# EAGLE design soar (EAGLE 8.3.1)
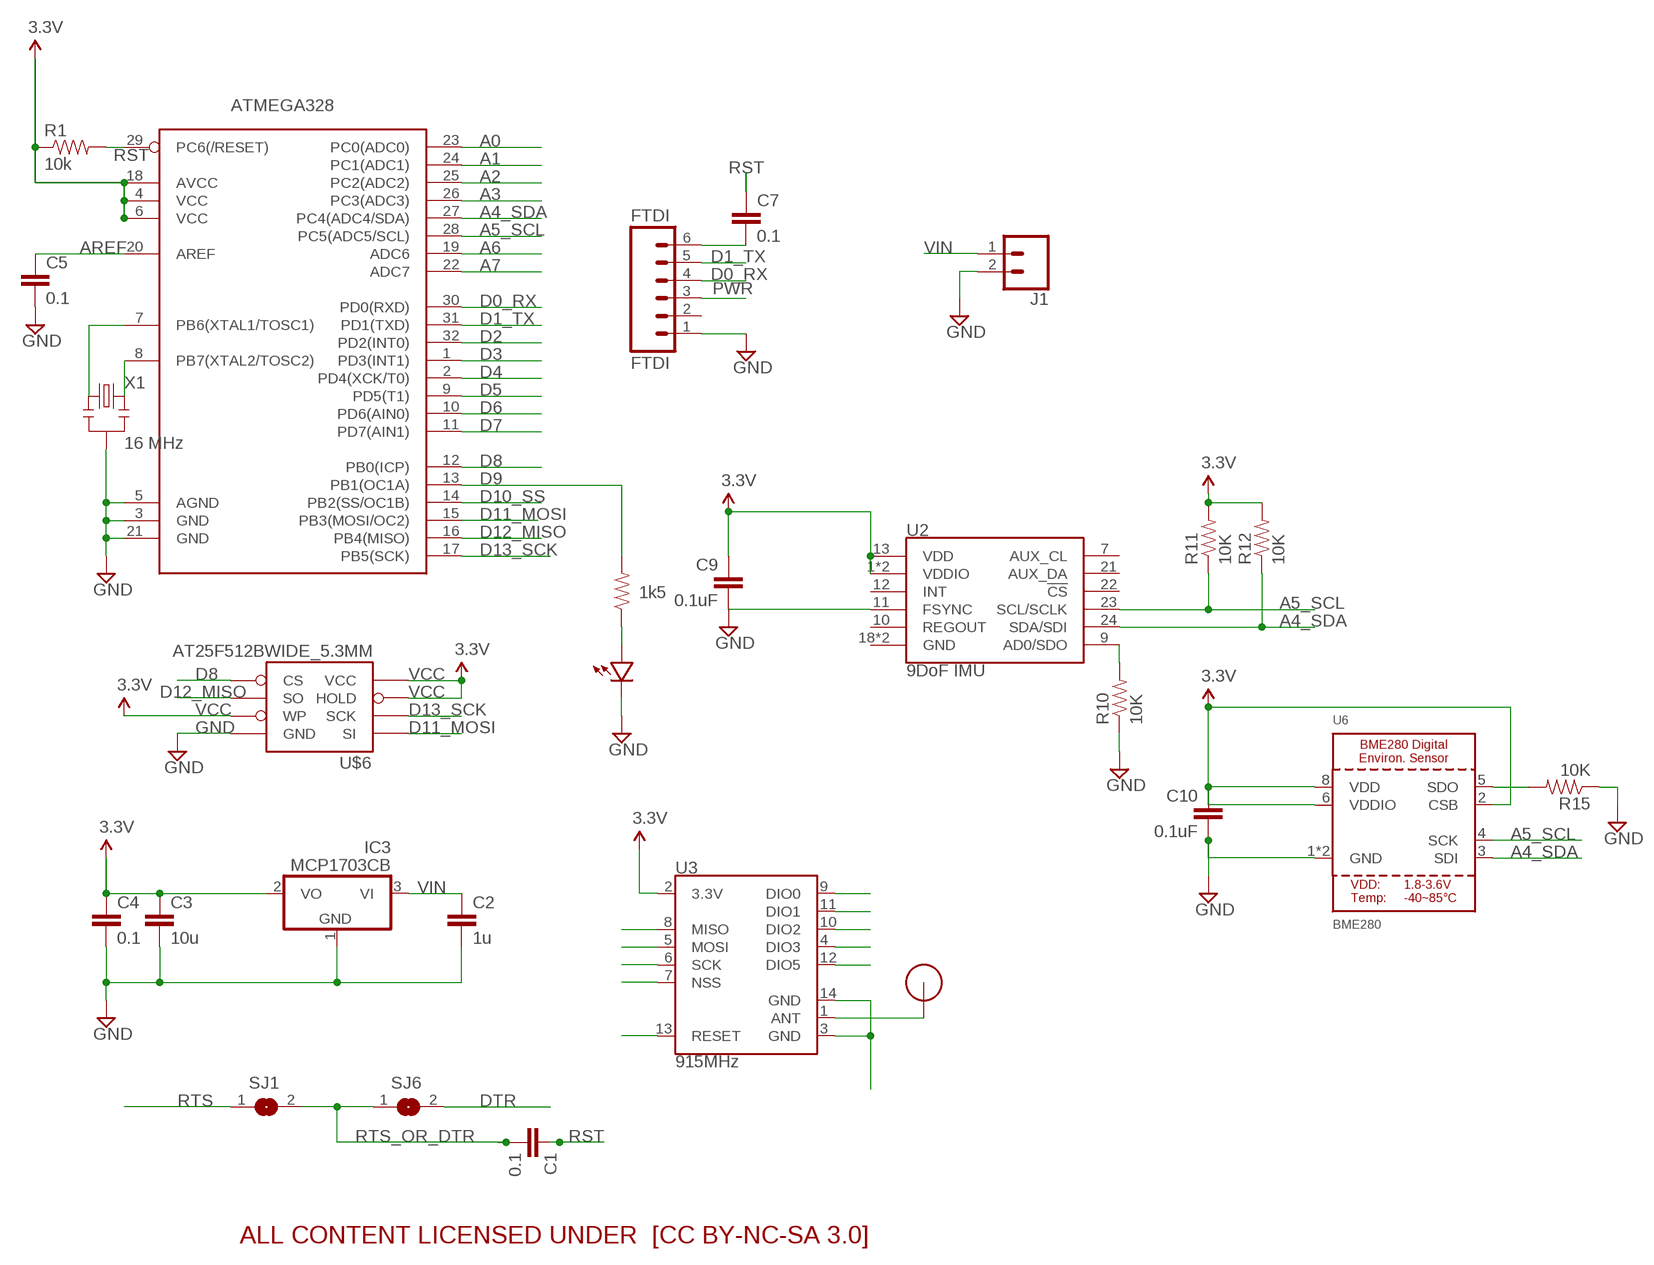
[diagram p0: schematic, sheet 1]

## Parts
ATMEGA328  ATMega-328  ATMEGA168/328TQFP32  [TQFP32-08]
C1  0.1  CAP0603-CAP  [0603-CAP]
C2  1u  CAP0603-CAP  [0603-CAP]
C3  10u  CAP0805-CAP  [0805-CAP]
C4  0.1  CAP0603-CAP  [0603-CAP]
C5  0.1  CAP0603-CAP  [0603-CAP]
C7  0.1  CAP0603-CAP  [0603-CAP]
C9  0.1uF  0.1UF-25V(+80/-20%)(0603)  [0603-CAP]
C10  0.1uF  0.1UF-25V(+80/-20%)(0603)  [0603-CAP]
FTDI  FTDI  M06SIP  [1X06]
IC3  MCP1703CB  [SOT23]
J1  CONN_02-JST-2-PTH-NO_SILK  [JST-2-PTH-NS]
R1  10k  RESISTOR0603-RES  [0603-RES]
R2  1k5  RESISTOR0603-RES  [0603-RES]
R10  10K  10KOHM-1/10W-1%(0603)0603  [0603-RES]
R11  10K  10KOHM-1/10W-1%(0603)0603  [0603-RES]
R12  10K  10KOHM-1/10W-1%(0603)0603  [0603-RES]
R15  10K  10KOHM-1/10W-1%(0603)0603  [0603-RES]
SJ1  JUMPER  [SJW]
SJ6  JUMPER  [SJW]
U2  9DoF IMU  MPU-9250  [QFN24-3X3]
U3  915MHz  RFM69CW-915MHZ  [RFM69CW-XXXS2]
U6  BME280  [BME280]
U$2  LED0603  [0603-LED]
U$3  RFM12B_ANTENNA  [RFM12B-ANTENNA]
U$6  AT25F512BWIDE_5.3MM  [SO08WIDE]
X1  16 MHz  RESONATORSMD  [RESONATOR-SMD]

## Nets
A0: ATMEGA328.23(PC0(ADC0))
A1: ATMEGA328.24(PC1(ADC1))
A2: ATMEGA328.25(PC2(ADC2))
A3: ATMEGA328.26(PC3(ADC3))
A4_SDA: ATMEGA328.27(PC4(ADC4/SDA)) R12.1 U2.24(SDA/SDI) U6.3(SDI)
A5_SCL: ATMEGA328.28(PC5(ADC5/SCL)) R11.1 U2.23(SCL/SCLK) U6.4(SCK)
A6: ATMEGA328.19(ADC6)
A7: ATMEGA328.22(ADC7)
AREF: ATMEGA328.20(AREF) C5.1
D0_RX: ATMEGA328.30(PD0(RXD)) FTDI.4
D1_TX: ATMEGA328.31(PD1(TXD)) FTDI.5
D2: ATMEGA328.32(PD2(INT0)) U3.9(DIO0)
D3: ATMEGA328.1(PD3(INT1))
D4: ATMEGA328.2(PD4(XCK/T0))
D5: ATMEGA328.9(PD5(T1))
D6: ATMEGA328.10(PD6(AIN0))
D7: ATMEGA328.11(PD7(AIN1))
D8: ATMEGA328.12(PB0(ICP)) U$6.1(CS)
D9: ATMEGA328.13(PB1(OC1A)) R2.2
D10_SS: ATMEGA328.14(PB2(SS/OC1B)) U3.7(NSS)
D11_MOSI: ATMEGA328.15(PB3(MOSI/OC2)) U3.5(MOSI) U$6.5(SI)
D12_MISO: ATMEGA328.16(PB4(MISO)) U3.8(MISO) U$6.2(SO)
D13_SCK: ATMEGA328.17(PB5(SCK)) U3.6(SCK) U$6.6(SCK)
DTR: SJ6.2
GND [power]: ATMEGA328.3(GND) ATMEGA328.5(AGND) ATMEGA328.21(GND) C2.2 C3.2 C4.2 C5.2 C10.2 FTDI.1 IC3.1(GND) J1.2 R10.1 R15.1 U6.1(GND) U6.7(GND) U$2.MINUS U$6.4(GND) X1.2
N$1: ATMEGA328.7(PB6(XTAL1/TOSC1)) X1.1
N$2: R2.1 U$2.PLUS
N$3: C9.2 U2.11(FSYNC)
N$10: R15.2 U6.5(SDO)
N$11: R10.2 U2.9(AD0/SDO)
N$12: C7.2 FTDI.6
N$14: U3.13(RESET)
N$16: U3.11(DIO1)
N$17: U3.10(DIO2)
N$18: U3.4(DIO3)
N$19: U3.12(DIO5)
N$20: U3.3(GND) U3.14(GND)
N$21: ATMEGA328.8(PB7(XTAL2/TOSC2)) X1.3
N$22: U3.1(ANT) U$3.P$1
PWR [power]: FTDI.3
RST: ATMEGA328.29(PC6(/RESET)) C1.1 C7.1 R1.2
RTS: SJ1.1
RTS_OR_DTR: C1.2 SJ1.2 SJ6.1
VCC: ATMEGA328.4(VCC) ATMEGA328.6(VCC) ATMEGA328.18(AVCC) C3.1 C4.1 C9.1 C10.1 IC3.2(VO) R1.1 R11.2 R12.2 U2.1(VDDIO) U2.8(VDDIO) U2.13(VDD) U3.2(3.3V) U6.2(CSB) U6.6(VDDIO) U6.8(VDD) U$6.3(WP) U$6.7(HOLD) U$6.8(VCC) ; supply symbol labelled 3.3V
VIN: C2.1 IC3.3(VI) J1.1
Unconnected: FTDI.2 U2.7(AUX_CL) U2.10(REGOUT) U2.12(INT) U2.18(GND) U2.20(GND) U2.21(AUX_DA) U2.22(!CS)

## Notes on the sheet
- ALL CONTENT LICENSED UNDER  [CC BY-NC-SA 3.0]

## Library data of the parts
ATMEGA328 = LowPowerLab:ATMEGA168/328: Atmel 32-pin 8-bit micro, 16k flash.
C1-C5 C7 = LowPowerLab:CAP: Capacitor Standard 0603 ceramic capacitor, and 0.1" leaded capacitor.
C9 C10 = SparkFun-Capacitors:0.1UF-25V(+80/-20%)(0603): CAP-00810 Ceramic Standard decoupling cap; PROD_ID: CAP-00810
FTDI = SparkFun-Connectors:M06: Header 6 Standard 6-pin 0.1" header. Use with straight break away headers (SKU : PRT-00116), right angle break away headers (PRT-00553), swiss pins (PRT-00743), machine pins (PRT-00117), and female headers (PRT-00115). Molex polarized connector foot print use with SKU : PRT-08094 with associated crimp pins and housings. NOTES ON THE VARIANTS LOCK and LOCK_LONGPADS... This footprint was designed to help hold the alignment of a through-hole component (i.e. 6-pin header) while soldering it into place. You may notice that each hole has been shifted either up or down by 0.005 of an inch from it's more standard position (which is a perfectly straight line). This slight alteration caused the pins (the squares in the middle) to touch the edges of the holes. Because they are alternating, it causes a "brace" to hold the component in place. 0.005 has proven to be the perfect amount of "off-center" position when using our standard breakaway headers. Although looks a little odd when you look at the bare footprint, once you have a header in there, the alteration is very hard to notice. Also, if you push a header all the way into place, it is covered up entirely on the bottom side. This idea of altering the position of holes to aid alignment will be further integrated into the Sparkfun Library for other footprints. It can help hold any component with 3 or more connection pins.
IC3 = linear:MCP1703: 250 mA, 16V, Low Quiescent Current LDO Regulator Source: http://ww1.microchip.com/downloads/en/DeviceDoc/22049b.pdf
J1 = SparkFun-Connectors:CONN_02: Multi connection point. Often used as Generic Header-pin footprint for 0.1 inch spaced/style header connections On any of the 0.1 inch spaced packages, you can populate with these: Break Away Headers - Straight <https://www.sparkfun.com/products/116> (PRT-00116) Break Away Male Headers - Right Angle <https://www.sparkfun.com/products/553> (PRT-00553) Female Headers <https://www.sparkfun.com/products/115> (PRT-00115) Break Away Headers - Machine Pin <https://www.sparkfun.com/products/117> (PRT-00117) Break Away Female Headers - Swiss Machine Pin <https://www.sparkfun.com/products/743> (PRT-00743) For SCREWTERMINALS and SPRING TERMINALS visit here: Screw Terimnals on SparkFun.com <https://www.sparkfun.com/search/results?term=Screw+Terminals> (5mm/3.5mm/2.54mm spacing) This device is also useful as a general connection point to wire up your design to another part of your project. Our various solder wires solder well into these plated through hole pads. Hook-Up Wire - Assortment (Stranded, 22 AWG) <https://www.sparkfun.com/products/11375> (PRT-11375) Hook-Up Wire - Assortment (Solid Core, 22 AWG) <https://www.sparkfun.com/products/11367> (PRT-11367) View the entire wire category on our website here <https://www.sparkfun.com/categories/141> Special notes: Molex polarized connector foot print use with: PRT-08233 with associated crimp pins and housings. 2.54_SCREWTERM for use with PRT-10571. 3.5mm Screw Terminal footprints for PRT-08084 5mm Screw Terminal footprints for use with PRT-08432
R1 R2 = LowPowerLab:RESISTOR: Resistor Basic schematic elements and footprints for 0603, 1206, and PTH resistors.
R10-R12 R15 = SparkFun-Resistors:10KOHM-1/10W-1%(0603): RES-00824; PROD_ID: RES-00824
SJ1 SJ6 = LowPowerLab:JUMPER
U2 = SparkFun-Sensors:MPU-9250: MPU-9250 9 Degree of Freedom IMU System in Package that contains MPU-6500 & AK8963 NC pin 19. 2-6 & 14-17 not internally connected. May be used for PCB trace routing. Datasheet <https://cdn.sparkfun.com/assets/learn_tutorials/5/5/0/MPU9250REV1.0.pdf> SparkFun Products: SparkFun 9DoF Razor IMU M0 <https://www.sparkfun.com/products/14001> SparkFun IMU Breakout - MPU-9250 <https://www.sparkfun.com/products/13762>; PROD_ID: IC-13192
U3 = SparkFun-RF:RFM69: Hope RF RFM69CW ISM Transceiver Module The RFM69CW radio module by HopeRF is a compact, powerful radio transceiver module for swapping data packets in the 868 MHz ISM band, using standard and enhanced FSK modulation. The radio is great for sub-compact designs; just 4mm of mounted height from using an SMD precision crystal. Datasheet <http://www.hoperf.com/upload/rf/RFM69CW-V1.1.pdf>; PROD_ID: IC-11996
U6 = microbuilder:BME280: BME280 - Environmental Sensor (I2C + SPI)
U$2 = LowPowerLab:LED
U$3 = LowPowerLab:RFM12B_ANTENNA
U$6 = LowPowerLab:AT25F512B: 4-Mbit SPI flash memory
X1 = SparkFun:RESONATOR: Resonator Small SMD resonator. This is the itty bitty 10/20MHz resonators with built in caps. CSTCE10M0G55 and CSTCE20M0V53. Footprint has been reviewed closely but hasn't been tested yet.

## Net classes
1 power: width 0.381 mm, clearance 0.254 mm

## Board
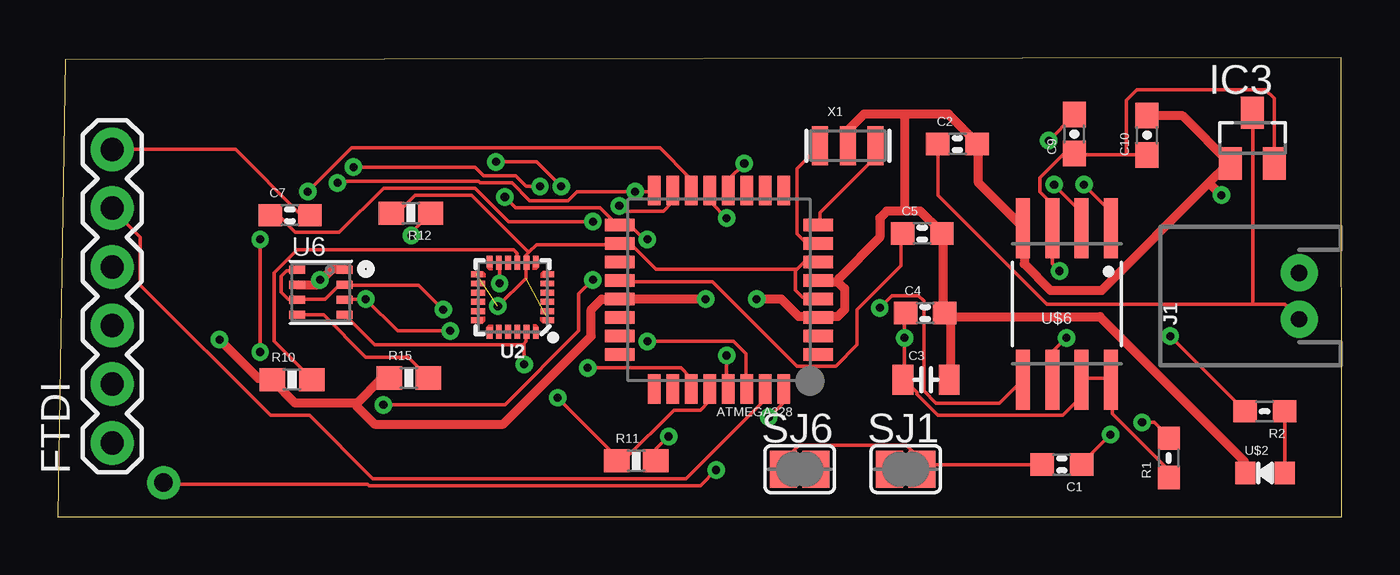
[diagram p1: board, top side]
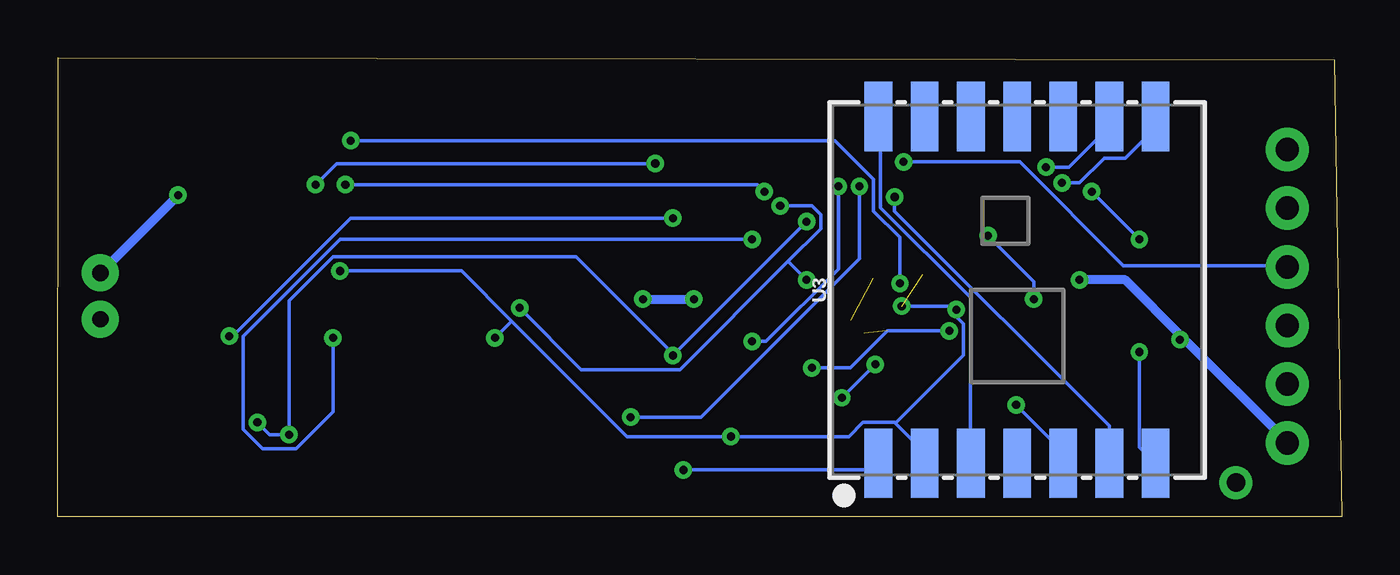
[diagram p2: board, bottom side, seen from below]

Size 55.58 x 19.86 mm. Coordinates in mm from the lower left corner, seen from the top.
Outline: 0,0 55.58,0 55.56,19.86 0.32,19.77 0,0
Copper layers (1*16): Top 0.035mm / dielectric 1.5mm / Bottom 0.035mm
Design rules "default": minimum track width 6mil, minimum drill 0.35mm, track to track 6mil, track to pad 6mil, pad to pad 6mil, via to via 6mil, smd to smd 6mil, copper to edge 40mil, drill to drill 6mil, minimum pad ring 10mil, minimum via ring 8mil, stop-mask expansion 4mil, vias tented up to drill 0mil, thermal gap 10mil

### Footprints (pad centres in the part's own frame; a part is rotated, then mirrored left to right if it is on the bottom)
TQFP32-08 = smd 1.27 x 0.533: 1 -4.293,2.8; 2 -4.293,2; 3 -4.293,1.2; 4 -4.293,0.4; 5 -4.293,-0.4; 6 -4.293,-1.2; 7 -4.293,-2; 8 -4.293,-2.8; 17 4.293,-2.8; 18 4.293,-2; 19 4.293,-1.2; 20 4.293,-0.4; 21 4.293,0.4; 22 4.293,1.2; 23 4.293,2; 24 4.293,2.8 | smd 0.533 x 1.27: 9 -2.8,-4.293; 10 -2,-4.293; 11 -1.2,-4.293; 12 -0.4,-4.293; 13 0.4,-4.293; 14 1.2,-4.293; 15 2,-4.293; 16 2.8,-4.293; 25 2.8,4.293; 26 2,4.293; 27 1.2,4.293; 28 0.4,4.293; 29 -0.4,4.293; 30 -1.2,4.293; 31 -2,4.293; 32 -2.8,4.293
0603-CAP = smd 1.016 x 0.965: 1 -0.85,0; 2 0.85,0
0805-CAP = smd 0.902 x 1.3: 1 -1,0; 2 1,0
0603-CAP' = smd 1.1 x 1: 1 -0.85,0; 2 0.85,0
1X06 = drill 1.016 pad 1.88: 1 0,0; 2 2.54,0; 3 5.08,0; 4 7.62,0; 5 10.16,0; 6 12.7,0
SOT23 = smd 1 x 1.4: 1 -0.95,-1.1; 2 0.95,-1.1; 3 0,1.1
JST-2-PTH-NS = drill 0.7 pad 1.6: 1 -1,0; 2 1,0
0603-RES = smd 1.016 x 0.965: 1 -0.85,0; 2 0.85,0
0603-RES' = smd 1.1 x 1: 1 -0.85,0; 2 0.85,0
SJW = smd 1.168 x 1.6: 1 -0.711,0; 2 0.711,0
QFN24-3X3 = smd 0.495 x 0.25: 1 -1.552,1; 6 -1.552,-1; 13 1.552,-1; 18 1.552,1 | smd 0.6 x 0.25: 2 -1.5,0.6; 3 -1.5,0.2; 4 -1.5,-0.2; 5 -1.5,-0.6; 14 1.5,-0.6; 15 1.5,-0.2; 16 1.5,0.2; 17 1.5,0.6 | smd 0.25 x 0.495: 7 -1,-1.552; 12 1,-1.552; 19 1,1.552; 24 -1,1.552 | smd 0.25 x 0.6: 8 -0.6,-1.5; 9 -0.2,-1.5; 10 0.2,-1.5; 11 0.6,-1.5; 20 0.6,1.5; 21 0.2,1.5; 22 -0.2,1.5; 23 -0.6,1.5
RFM69CW-XXXS2 = smd 3 x 1.2: 1 -7.5,6; 2 -7.5,4; 3 -7.5,2; 4 -7.5,0; 5 -7.5,-2; 6 -7.5,-4; 7 -7.5,-6; 8 7.5,-6; 9 7.5,-4; 10 7.5,-2; 11 7.5,0; 12 7.5,2; 13 7.5,4; 14 7.5,6
BME280 = smd 0.7 x 0.35: 1 1.025,0.975; 2 1.025,0.325; 3 1.025,-0.325; 4 1.025,-0.975; 5 -1.025,-0.975; 6 -1.025,-0.325; 7 -1.025,0.325; 8 -1.025,0.975
0603-LED = smd 0.864 x 0.965: MINUS -0.85,0; PLUS 0.85,0
RFM12B-ANTENNA = drill 0.8 pad 1.422: P$1 0,0
SO08WIDE = smd 0.61 x 2.6: 1 -1.905,-3.269; 2 -0.635,-3.269; 3 0.635,-3.269; 4 1.905,-3.269; 5 1.905,3.286; 6 0.635,3.286; 7 -0.635,3.286; 8 -1.905,3.286
RESONATOR-SMD = smd 0.7 x 1.7: 1 -1.2,0; 2 0,0; 3 1.2,0

### Placement (x,y rotation side)
ATMEGA328  28.62,9.82 180 top
C1  43.46,2.26 180 top
C2  38.94,16.13 0 top
C3  37.59,5.94 0 top
C4  37.55,8.81 0 top
C5  37.42,12.26 0 top
C7  10.06,13.05 0 top
C9  0.1uF  [0603-CAP']  44,16.56 90 top
C10  0.1uF  [0603-CAP']  47.15,16.51 90 top
FTDI  2.36,3.2 90 top
IC3  51.71,16.38 0 top
J1  53.73,9.55 90 top
R1  48.09,2.55 90 top
R2  52.24,4.57 180 top
R10  10K  [0603-RES']  10.14,5.93 0 top
R11  10K  [0603-RES']  25.04,2.42 0 top
R12  10K  [0603-RES']  15.29,13.14 180 top
R15  10K  [0603-RES']  15.2,6 0 top
SJ1  36.7,2.06 0 top
SJ6  32.12,2.06 0 top
U2  19.69,9.5 180 top
U3  14.06,9.82 90 bottom
U6  11.39,9.72 0 top
U$2  52.26,1.9 0 top
U$3  4.58,1.48 0 top
U$6  43.68,9.22 180 top
X1  34.2,16.06 0 top

### Tracks (layer width: path | path; a pad name or v marks a point on that pad's centre or on a via)
A4_SDA  (via drill 0.35)  (1 unrouted)
  Top 0.152: v15.31,12.16 15.31,12.31 16.08,13.08 R12.1 | U6.3 12.42,9.42 v13.33,9.42 14.7,8.05 v16.99,8.05 | v22.93,6.45 26.97,6.45 27.35,6.07 27.35,5.53 ATMEGA328.27
  Bottom 0.152: v13.33,9.42 13.33,10.18 v15.31,12.16 | v22.93,6.45 21.26,6.45 19.66,8.05 v16.99,8.05
A5_SCL  (via drill 0.35)
  Top 0.152: ATMEGA328.28 28.19,5.46 28.19,5 27.81,4.62 26.67,4.62 24.53,2.48 24.23,2.48 R11.1 24.23,2.56 v21.64,5.15 | 20.15,7.47 20.11,7.44 13.71,7.44 U6.4 | 20.15,7.47 20.27,7.59 20.27,7.97 U2.23 | v20.19,6.6 20.19,7.44 20.15,7.47
  Bottom 0.152: v20.19,6.6 v21.64,5.15
AREF
  Top 0.152: C5.1 36.5,12.24 36.5,10.87 34.59,8.96 34.59,7.44 33.68,6.52 32,6.52 28.34,10.18 24.38,10.18 ATMEGA328.20
D0_RX  (via drill 0.35)
  Top 0.152: v25.52,7.59 29.26,7.59 29.79,7.06 29.79,5.53 ATMEGA328.30 | v21.79,14.29 20.72,15.36 v18.97,15.36
  Bottom 0.152: v25.52,7.59 24.92,7.59 21.79,10.71 v21.79,14.29 | v18.97,15.36 13.94,15.36 9.45,10.87 2.36,10.87 FTDI.4
D1_TX
  Top 0.152: ATMEGA328.31 30.55,5.46 30.55,5 27.2,1.65 13.64,1.65 10.89,4.39 9.22,4.39 3.58,10.03 3.58,12.08 2.36,13.3 FTDI.5
D2  (via drill 0.35)
  Top 0.152: v30.78,4.31 31.39,4.92 31.39,5.46 ATMEGA328.32 | v20.88,14.29 20.27,14.29 19.81,14.75 18.44,14.75 18.06,15.13 v12.8,15.13
  Bottom 0.152: v30.78,4.31 27.73,4.31 20.88,11.17 v20.88,14.29 | v12.8,15.13 11.81,15.13 10.06,16.89 10.06,17.27 U3.9
D8  (via drill 0.35)
  Top 0.152: v29.72,15.29 29.03,14.6 29.03,14.14 ATMEGA328.12 | v44.42,14.37 45.57,13.23 45.57,12.54 U$6.1
  Bottom 0.152: v29.72,15.29 43.51,15.29 v44.42,14.37
D9  (via drill 0.35)
  Top 0.152: v48.16,7.82 51.36,4.62 R2.2 | v28.95,12.92 28.27,13.61 28.27,14.07 ATMEGA328.13
  Bottom 0.152: v48.16,7.82 48,7.82 42.9,12.92 v28.95,12.92
D10_SS  (via drill 0.35)
  Top 0.152: v10.82,14.07 12.72,15.97 26.06,15.97 27.35,14.68 27.35,14.14 ATMEGA328.14 | v8.76,7.13 v8.76,12.01
  Bottom 0.152: v8.76,12.01 v10.82,14.07 | v8.76,7.13 8.76,3.02 8.07,2.33 U3.7
D11_MOSI  (via drill 0.35)
  Top 0.152: v24.31,13.46 24.53,13.23 26.21,13.23 26.59,13.61 26.59,14.07 ATMEGA328.15 | v35.58,9.04 36.12,9.57 37.26,9.57 37.49,9.34 37.49,5.46 38.02,4.92 40.76,4.92 41.76,5.91 U$6.5 | v14.09,4.85 19.35,4.85 22.55,8.05 22.55,9.65 v23.16,10.26
  Bottom 0.152: v24.31,13.46 22.93,13.46 22.55,13.08 22.55,12.47 23.96,11.06 | 23.96,11.06 28.65,6.37 32.92,6.37 v35.58,9.04 | v14.09,4.85 12.11,2.86 12.11,2.33 U3.5 | 23.96,11.06 v23.16,10.26
D12_MISO  (via drill 0.35)
  Top 0.152: v12.11,14.45 12.19,14.52 18.21,14.52 18.29,14.45 19.66,14.45 20.42,13.69 22.1,13.69 22.48,14.07 v24.99,14.07 25.75,14.07 ATMEGA328.16 | v43.13,14.37 44.27,13.23 44.27,12.54 U$6.2
  Bottom 0.152: v12.11,14.45 11.35,14.45 10.28,15.51 9.37,15.51 8.07,16.81 8.07,17.27 U3.8 | v43.13,14.37 25.3,14.37 v24.99,14.07
D13_SCK  (via drill 0.35)
  Top 0.152: v19.35,13.84 19.81,13.38 23.47,13.38 24.15,12.69 24.31,12.69 ATMEGA328.17 24.38,12.62 24.76,12.62 25.37,12.01 v25.52,12.01 | v43.66,7.74 43.05,7.13 43.05,5.99 U$6.6
  Bottom 0.152: v19.35,13.84 19.35,13.23 10.06,3.93 10.06,2.33 U3.6 | v43.66,7.74 43.66,4.54 45.26,2.94 46.71,2.94 47.55,3.78 47.55,7.82 43.36,12.01 v25.52,12.01
GND  (via drill 0.35)
  Top 0.381: 12.95,4.92 10.28,4.92 9.29,5.91 R10.1 9.14,5.99 8.68,5.99 v7.01,7.67 | 12.95,4.92 14.02,5.99 14.32,5.99 R15.1 | 12.95,4.92 12.95,4.77 13.71,4.01 19.28,4.01 23.09,7.82 23.09,8.96 23.54,9.42 24.31,9.42 ATMEGA328.21 24.46,9.42 v28.04,9.42 | 11.39,10.22 11.88,10.71 12.34,10.71 U6.1 | 11.39,10.22 11.2,10.03 10.44,10.03 U6.7 | v11.35,10.26 11.39,10.22 | 33.75,10.18 34.06,9.88 34.06,8.96 33.75,8.66 32.99,8.66 ATMEGA328.3 32.76,8.66 32.08,8.66 31.32,9.42 v30.25,9.42 | 33.75,10.18 32.99,10.18 ATMEGA328.5 | U$2.MINUS 51.36,1.95 51.36,2.41 45.11,8.66 38.55,8.66 C4.2 | C4.2 38.33,8.96 38.33,12.24 C5.2 38.17,12.39 37.34,13.23 36.65,13.23 | C3.2 38.63,5.99 38.63,8.5 C4.2 | 36.65,13.23 35.89,13.23 35.58,12.92 35.58,12.08 33.83,10.33 33.75,10.18 | C10.2 47.17,17.34 48.69,17.34 IC3.1 50.59,15.21 49.83,14.45 | 36.65,17.42 38.55,17.42 39.7,16.28 C2.2 39.85,16.12 39.85,14.45 41.76,12.54 U$6.4 41.83,12.31 41.83,10.94 42.97,9.8 45.18,9.8 49.83,14.45 | 36.65,17.42 34.9,17.42 34.21,16.73 34.21,16.12 X1.2 | 49.83,14.45 v50.37,13.91 | 36.65,17.42 36.65,13.23
  Bottom 0.381: v11.35,10.26 9.37,10.26 6.89,7.78 | 6.89,7.78 2.36,3.25 FTDI.1 | v7.01,7.67 6.89,7.78 | v50.37,13.91 J1.2 | v30.25,9.42 v28.04,9.42
N$1
  Top 0.152: ATMEGA328.7 32.92,11.86 32.38,11.86 32,12.24 32,15.06 X1.1
N$2
  Top 0.152: U$2.PLUS 53.11,1.95 53.11,4.54 R2.1
N$3  (via drill 0.35)
  Top 0.152: v19.12,10.1 19.12,10.94 U2.11 | v42.9,16.28 43.97,17.34 C9.2
  Bottom 0.152: v19.12,10.1 19.12,12.08 20.27,13.23 20.27,14.6 21.94,16.28 v42.9,16.28
N$10
  Top 0.152: U6.5 10.44,8.73 11.5,8.73 13.33,6.9 15.16,6.9 16,6.07 R15.2
N$11
  Top 0.152: U2.9 19.89,11.02 19.89,11.4 19.73,11.55 10.36,11.55 9.37,10.56 9.37,7.59 10.97,5.99 R10.2
N$12
  Top 0.152: C7.2 10.89,13.08 10.51,13.08 7.69,15.89 FTDI.6
N$20
  Bottom 0.152: U3.3 16.08,2.33 16.08,9.49 19.96,13.38 19.96,17.19 20.04,17.27 U3.14
N$21
  Top 0.152: ATMEGA328.8 32.99,12.69 32.99,13.15 35.35,15.51 35.35,16.05 X1.3
N$22  (via drill 0.35)
  Top 0.152: v28.5,2.03 27.81,1.34 13.49,1.34 13.41,1.42 4.65,1.42 U$3.P$1
  Bottom 0.152: v28.5,2.03 20.34,2.03 20.11,2.26 U3.1
RST  (via drill 0.35)
  Top 0.152: v45.57,3.55 44.35,2.33 C1.1 | v46.94,4.08 47.47,4.08 48.08,3.47 R1.2 | v23.16,12.77 19.5,12.77 18.06,14.22 14.09,14.22 12.19,12.31 10.28,12.31 9.6,13 9.22,13 C7.1 | v28.95,6.98 28.95,5.53 ATMEGA328.29
  Bottom 0.152: v46.94,4.08 46.4,3.55 v45.57,3.55 45.57,9.34 43.66,11.25 33.14,11.25 28.95,7.06 v28.95,6.98 v23.16,12.77
RTS_OR_DTR
  Top 0.152: C1.2 42.59,2.26 37.64,2.26 37.49,2.1 SJ1.2 37.56,2.26 36.73,3.09 32.08,3.09 31.47,2.48 31.47,2.1 SJ6.1
VCC  (via drill 0.35)  (2 unrouted)
  Top 0.152: 31.96,10.68 32.31,11.02 ATMEGA328.6 | 31.96,10.68 31.93,10.64 31.93,9.8 32.23,9.49 32.92,9.49 ATMEGA328.4 | 20.38,11.44 20.72,11.78 24.31,11.78 ATMEGA328.18 24.38,11.78 24.84,11.78 25.91,10.71 31.93,10.71 31.96,10.68 | 20.38,11.44 20.27,11.32 20.27,11.02 U2.8 20.27,10.94 20.27,10.33 v19.05,9.11 | 20.38,11.44 17.9,13.91 15.47,13.91 14.7,13.15 14.48,13.15 R12.2 | R1.1 48.08,1.72 48.08,2.03 45.64,4.46 45.64,5.91 U$6.8 45.57,5.99 44.35,5.99 U$6.7 44.27,5.91 44.27,5.15 43.51,4.39 38.1,4.39 37.18,5.3 37.18,5.38 36.65,5.91 C3.1 36.65,5.99 v36.65,7.74 36.65,8.81 C4.1 | 46.25,15.67 47.09,15.67 C10.1 | 46.25,15.67 44.04,15.67 C9.1 43.97,15.67 43.51,15.67 42.52,14.68 42.52,14.07 42.97,13.61 42.97,12.54 U$6.3 43.05,12.47 43.05,10.94 v43.36,10.64 | 46.25,15.67 46.25,18.03 46.71,18.49 52.27,18.49 52.65,18.1 IC3.2 | U6.8 10.36,10.64 9.9,10.64 9.68,10.41 9.68,9.72 9.98,9.42 10.36,9.42 U6.6 10.44,9.42 11.58,9.42 12.19,10.03 12.34,10.03 U6.2 12.49,10.03 15.62,10.03 v16.69,8.96 | v26.44,3.47 25.91,2.94 25.91,2.48 R11.2
  Bottom 0.152: 19.31,4.05 18.06,2.79 18.06,2.33 U3.2 | 19.31,4.05 19.35,4.08 20.72,4.08 21.33,3.47 v26.44,3.47 30.93,3.47 35.93,8.47 | 19.31,4.05 16.38,6.98 16.38,8.35 16.69,8.66 v16.69,8.96 16.84,9.11 v19.05,9.11 | v43.36,10.64 38.1,10.64 35.93,8.47 | 35.93,8.47 v36.65,7.74
VIN
  Top 0.152: 51.74,9.19 53.11,9.19 53.72,8.58 J1.1 | 51.74,9.19 42.82,9.19 38.1,13.91 C2.1 | 51.74,9.19 51.74,17.42 IC3.3